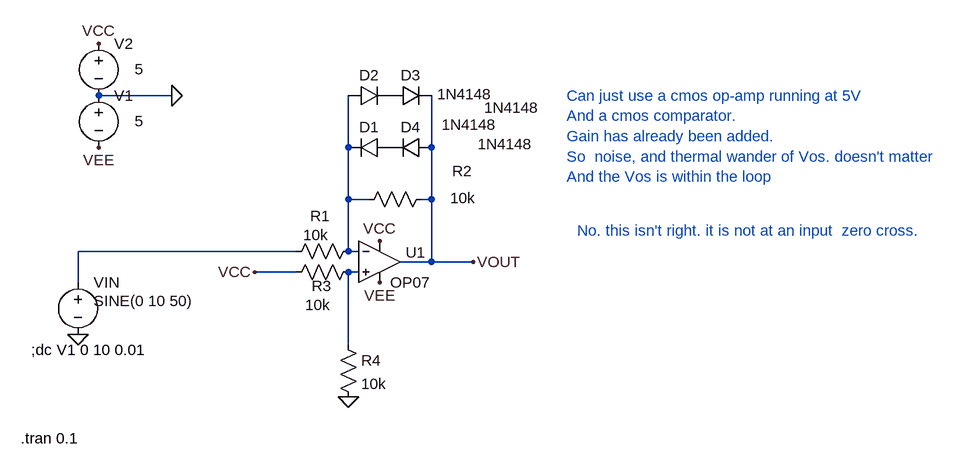
[diagram p0: schematic Draft100.asc]
Draft100.asc, the LTspice schematic file:
Version 4
SHEET 1 1316 680
WIRE 96 -160 -16 -160
WIRE 368 -80 368 -160
WIRE 496 -80 496 -160
WIRE 368 0 368 -80
WIRE 400 0 368 0
WIRE 496 0 496 -80
WIRE 496 0 480 0
WIRE 288 80 -48 80
WIRE 368 80 368 0
WIRE 384 80 368 80
WIRE 496 96 496 0
WIRE 496 96 448 96
WIRE 560 96 496 96
WIRE 288 112 224 112
WIRE 384 112 368 112
WIRE -48 128 -48 80
WIRE 368 224 368 112
FLAG -48 208 0
FLAG 96 -160 0
FLAG 560 96 VOUT
FLAG 368 304 0
FLAG -16 -240 VCC
FLAG 416 64 VCC
FLAG 224 112 VCC
FLAG -16 -80 VEE
FLAG 416 128 VEE
SYMBOL voltage -48 112 R0
WINDOW 123 0 0 Left 0
WINDOW 39 0 0 Left 0
WINDOW 3 24 44 Left 2
SYMATTR Value SINE(0 10 50)
SYMATTR InstName VIN
SYMBOL OpAmps\\OP07 416 32 R0
WINDOW 0 40 50 Left 2
SYMATTR InstName U1
SYMBOL voltage -16 -256 R0
WINDOW 123 0 0 Left 0
WINDOW 39 0 0 Left 0
WINDOW 3 55 55 Left 2
SYMATTR Value 5
SYMATTR InstName V2
SYMBOL res 384 64 R90
WINDOW 0 -23 59 VBottom 2
WINDOW 3 -25 66 VTop 2
SYMATTR InstName R1
SYMATTR Value 10k
SYMBOL res 496 -16 R90
WINDOW 0 -12 -47 VBottom 2
WINDOW 3 -2 -48 VTop 2
SYMATTR InstName R2
SYMATTR Value 10k
SYMBOL res 384 96 R90
WINDOW 0 53 57 VBottom 2
WINDOW 3 51 63 VTop 2
SYMATTR InstName R3
SYMATTR Value 10k
SYMBOL res 352 208 R0
SYMATTR InstName R4
SYMATTR Value 10k
SYMBOL diode 432 -96 R90
WINDOW 0 0 32 VBottom 2
WINDOW 3 -35 -122 VTop 2
SYMATTR InstName D1
SYMATTR Value 1N4148
SYMBOL diode 368 -144 R270
WINDOW 0 32 32 VTop 2
WINDOW 3 34 179 VBottom 2
SYMATTR InstName D2
SYMATTR Value 1N4148
SYMBOL diode 432 -144 R270
WINDOW 0 32 32 VTop 2
WINDOW 3 13 187 VBottom 2
SYMATTR InstName D3
SYMATTR Value 1N4148
SYMBOL diode 496 -96 R90
WINDOW 0 0 32 VBottom 2
WINDOW 3 -5 -113 VTop 2
SYMATTR InstName D4
SYMATTR Value 1N4148
SYMBOL voltage -16 -176 R0
WINDOW 123 0 0 Left 0
WINDOW 39 0 0 Left 0
WINDOW 3 55 55 Left 2
SYMATTR Value 5
SYMATTR InstName V1
TEXT -120 232 Left 2 !;dc V1 0 10 0.01
TEXT -136 368 Left 2 !.tran 0.1
TEXT 704 -160 Left 2 ;Can just use a cmos op-amp running at 5V\nAnd a cmos comparator.\nGain has already been added.\nSo  noise, and thermal wander of Vos. doesn't matter\nAnd the Vos is within the loop
TEXT 720 48 Left 2 ;No. this isn't right. it is not at an input  zero cross.

The netlist it stands for:
* Draft100.asc
VIN N002 0 SINE(0 10 50)
XU1 N003 N001 VCC VEE VOUT LT1001  ; OP07, pins In+ In- V+ V- OUT
V2 VCC 0 5
R1 N001 N002 10k
R2 VOUT N001 10k
R3 N003 VCC 10k
R4 N003 0 10k
D1 P001 N001 1N4148
D2 N001 P002 1N4148
D3 P002 VOUT 1N4148
D4 VOUT P001 1N4148
V1 0 VEE 5
.model D D
.lib standard.dio
;dc V1 0 10 0.01
.tran 0.1
* Can just use a cmos op-amp running at 5V
* And a cmos comparator.
* Gain has already been added.
* So  noise, and thermal wander of Vos. doesn't matter
* And the Vos is within the loop
* No. this isn't right. it is not at an input  zero cross.
.lib LTC.lib
.backanno
.end